# Altium project foxbms2-master.PrjPcb (part 7 of 7)

## Sheet connectors-interface.SchDoc
size A3; DocumentNumber: 12; SheetNumber: 12; SheetTotal: 45; SheetDescription: Connector to Interface Board
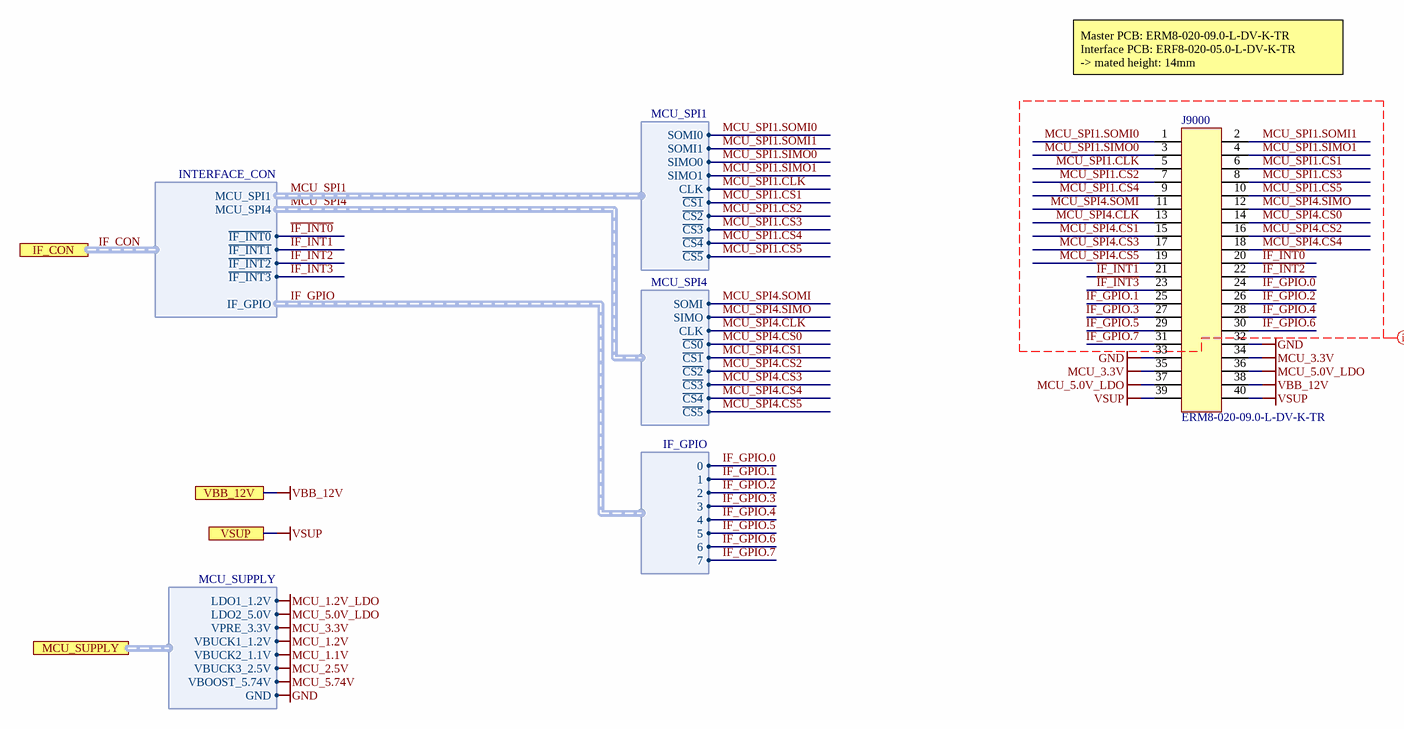
[diagram p22: connectors-interface.SchDoc]

### Parts
J9000  ERM8-020-09.0-L-DV-K-TR  [SAMTEC_ERM8-020-09.0-L-DV-K]

### Ports
IF_CON (harness INTERFACE_CON), MCU_SUPPLY (harness MCU_SUPPLY), VBB_12V, VSUP

### Harnesses
MCU_SPI1: CLK, SIMO0, SOMI0, SOMI1, ~{CS1}, ~{CS2}, ~{CS3}, ~{CS4}, ~{CS5}, SIMO1
MCU_SPI4: CLK, SIMO, SOMI, ~{CS1}, ~{CS2}, ~{CS3}, ~{CS0}, ~{CS4}, ~{CS5}
IF_GPIO: 0, 1, 2, 3, 4, 5, 6, 7
INTERFACE_CON: MCU_SPI1, MCU_SPI4, ~{IF_INT0}, ~{IF_INT1}, ~{IF_INT2}, ~{IF_INT3}, IF_GPIO
MCU_SUPPLY: VBUCK1_1.2V, VBUCK2_1.1V, VBUCK3_2.5V, LDO1_1.2V, LDO2_5.0V, GND, VPRE_3.3V, VBOOST_5.74V

### Nets
GND: J9000.32 J9000.33 ; port MCU_SUPPLY.GND
MCU_3.3V: J9000.34 J9000.35 ; port MCU_SUPPLY.VPRE_3.3V
MCU_5.0V_LDO: J9000.36 J9000.37 ; port MCU_SUPPLY.LDO2_5.0V
VBB_12V: J9000.38 ; port VBB_12V
VSUP: J9000.39 J9000.40 ; port VSUP  [project net VSUP_30]
~{IF_INT0}: J9000.20 ; port IF_CON.~{IF_INT0}  [project net IF_CON~{.}IF_INT0]
~{IF_INT1}: J9000.21 ; port IF_CON.~{IF_INT1}  [project net IF_CON~{.}IF_INT1]
~{IF_INT2}: J9000.22 ; port IF_CON.~{IF_INT2}  [project net IF_CON~{.}IF_INT2]
~{IF_INT3}: J9000.23 ; port IF_CON.~{IF_INT3}  [project net IF_CON~{.}IF_INT3]
~{MCU_SPI1.CS1}: J9000.6 ; harness MCU_SPI1.~{CS1}  [project net MCU_SPI1~{.}CS1]
~{MCU_SPI1.CS2}: J9000.7 ; harness MCU_SPI1.~{CS2}  [project net MCU_SPI1~{.}CS2]
~{MCU_SPI1.CS3}: J9000.8 ; harness MCU_SPI1.~{CS3}  [project net MCU_SPI1~{.}CS3]
~{MCU_SPI1.CS4}: J9000.9 ; harness MCU_SPI1.~{CS4}  [project net MCU_SPI1~{.}CS4]
~{MCU_SPI1.CS5}: J9000.10 ; harness MCU_SPI1.~{CS5}  [project net MCU_SPI1~{.}CS5]
~{MCU_SPI4.CS0}: J9000.14 ; harness MCU_SPI4.~{CS0}  [project net MCU_SPI4~{.}CS0]
~{MCU_SPI4.CS1}: J9000.15 ; harness MCU_SPI4.~{CS1}  [project net MCU_SPI4~{.}CS1]
~{MCU_SPI4.CS2}: J9000.16 ; harness MCU_SPI4.~{CS2}  [project net MCU_SPI4~{.}CS2]
~{MCU_SPI4.CS3}: J9000.17 ; harness MCU_SPI4.~{CS3}  [project net MCU_SPI4~{.}CS3]
~{MCU_SPI4.CS4}: J9000.18 ; harness MCU_SPI4.~{CS4}  [project net MCU_SPI4~{.}CS4]
~{MCU_SPI4.CS5}: J9000.19 ; harness MCU_SPI4.~{CS5}  [project net MCU_SPI4~{.}CS5]
IF_GPIO.0: J9000.24 ; harness IF_GPIO.0
IF_GPIO.1: J9000.25 ; harness IF_GPIO.1
IF_GPIO.2: J9000.26 ; harness IF_GPIO.2
IF_GPIO.3: J9000.27 ; harness IF_GPIO.3
IF_GPIO.4: J9000.28 ; harness IF_GPIO.4
IF_GPIO.5: J9000.29 ; harness IF_GPIO.5
IF_GPIO.6: J9000.30 ; harness IF_GPIO.6
IF_GPIO.7: J9000.31 ; harness IF_GPIO.7
MCU_SPI1.CLK: J9000.5 ; harness MCU_SPI1.CLK
MCU_SPI1.SIMO0: J9000.3 ; harness MCU_SPI1.SIMO0
MCU_SPI1.SIMO1: J9000.4 ; harness MCU_SPI1.SIMO1
MCU_SPI1.SOMI0: J9000.1 ; harness MCU_SPI1.SOMI0
MCU_SPI1.SOMI1: J9000.2 ; harness MCU_SPI1.SOMI1
MCU_SPI4.CLK: J9000.13 ; harness MCU_SPI4.CLK
MCU_SPI4.SIMO: J9000.12 ; harness MCU_SPI4.SIMO
MCU_SPI4.SOMI: J9000.11 ; harness MCU_SPI4.SOMI

### Buses and harness runs
harness IF_CON = port IF_CON

### Layout directives
net class CON_IF: IF_GPIO.0, IF_GPIO.1, IF_GPIO.2, IF_GPIO.3, IF_GPIO.4, IF_GPIO.5, IF_GPIO.6, IF_GPIO.7, MCU_SPI1.CLK, MCU_SPI1.SIMO0, MCU_SPI1.SIMO1, MCU_SPI1.SOMI0, MCU_SPI1.SOMI1, MCU_SPI4.CLK, MCU_SPI4.SIMO, MCU_SPI4.SOMI, ~{IF_INT0}, ~{IF_INT1}, ~{IF_INT2}, ~{IF_INT3}, ~{MCU_SPI1.CS1}, ~{MCU_SPI1.CS2}, ~{MCU_SPI1.CS3}, ~{MCU_SPI1.CS4}, ~{MCU_SPI1.CS5}, ~{MCU_SPI4.CS0}, ~{MCU_SPI4.CS1}, ~{MCU_SPI4.CS2}, ~{MCU_SPI4.CS3}, ~{MCU_SPI4.CS4}, ~{MCU_SPI4.CS5}

### Notes on the sheet
- Master PCB: ERM8-020-09.0-L-DV-K-TR
  Interface PCB: ERF8-020-05.0-L-DV-K-TR
  -> mated height: 14mm
- Fraunhofer IISB
- Schottkystr. 10
- developed by:
- 91058 Erlangen
- Germany
- Author
- Project
- License
- Description
- File
- Version
- Release Date
- Sheet
- foxbms.org <https://foxbms.org>
- www.iisb.fraunhofer.de <https://www.iisb.fraunhofer.de/>
- foxBMS Team
- /

### Library data of the parts
J9000 = SAMTEC_ERM8-020-09.0-L-DV-K-TR: Edge Rate rugged high-speed connector strips; Manufacturer: Samtec; Circuits: 40; Automotive Qualified: False; Part Number: SAMTEC_ERM8-020-09.0-L-DV-K-TR; Part Name: ERM8-020-09.0-L-DV-K-TR; Operating Temperature: -55°C - +125°C; ComponentLink1Description: Datasheet; ComponentLink1URL: https://suddendocs.samtec.com/catalog_english/erm8.pdf; Supplier 1: Farnell; Supplier Part Number 1: 3551150; Supplier 2: Samtec; Supplier Part Number 2: ERM8-020-09.0-L-DV-K-TR; Supplier 3: RS Components; Supplier Part Number 3: 1798876; ECCN: EAR99; System: Connector

## Sheet connectors-extension.SchDoc
size A3; DocumentNumber: 10; SheetNumber: 10; SheetTotal: 45; SheetDescription: Connector to Extension Board
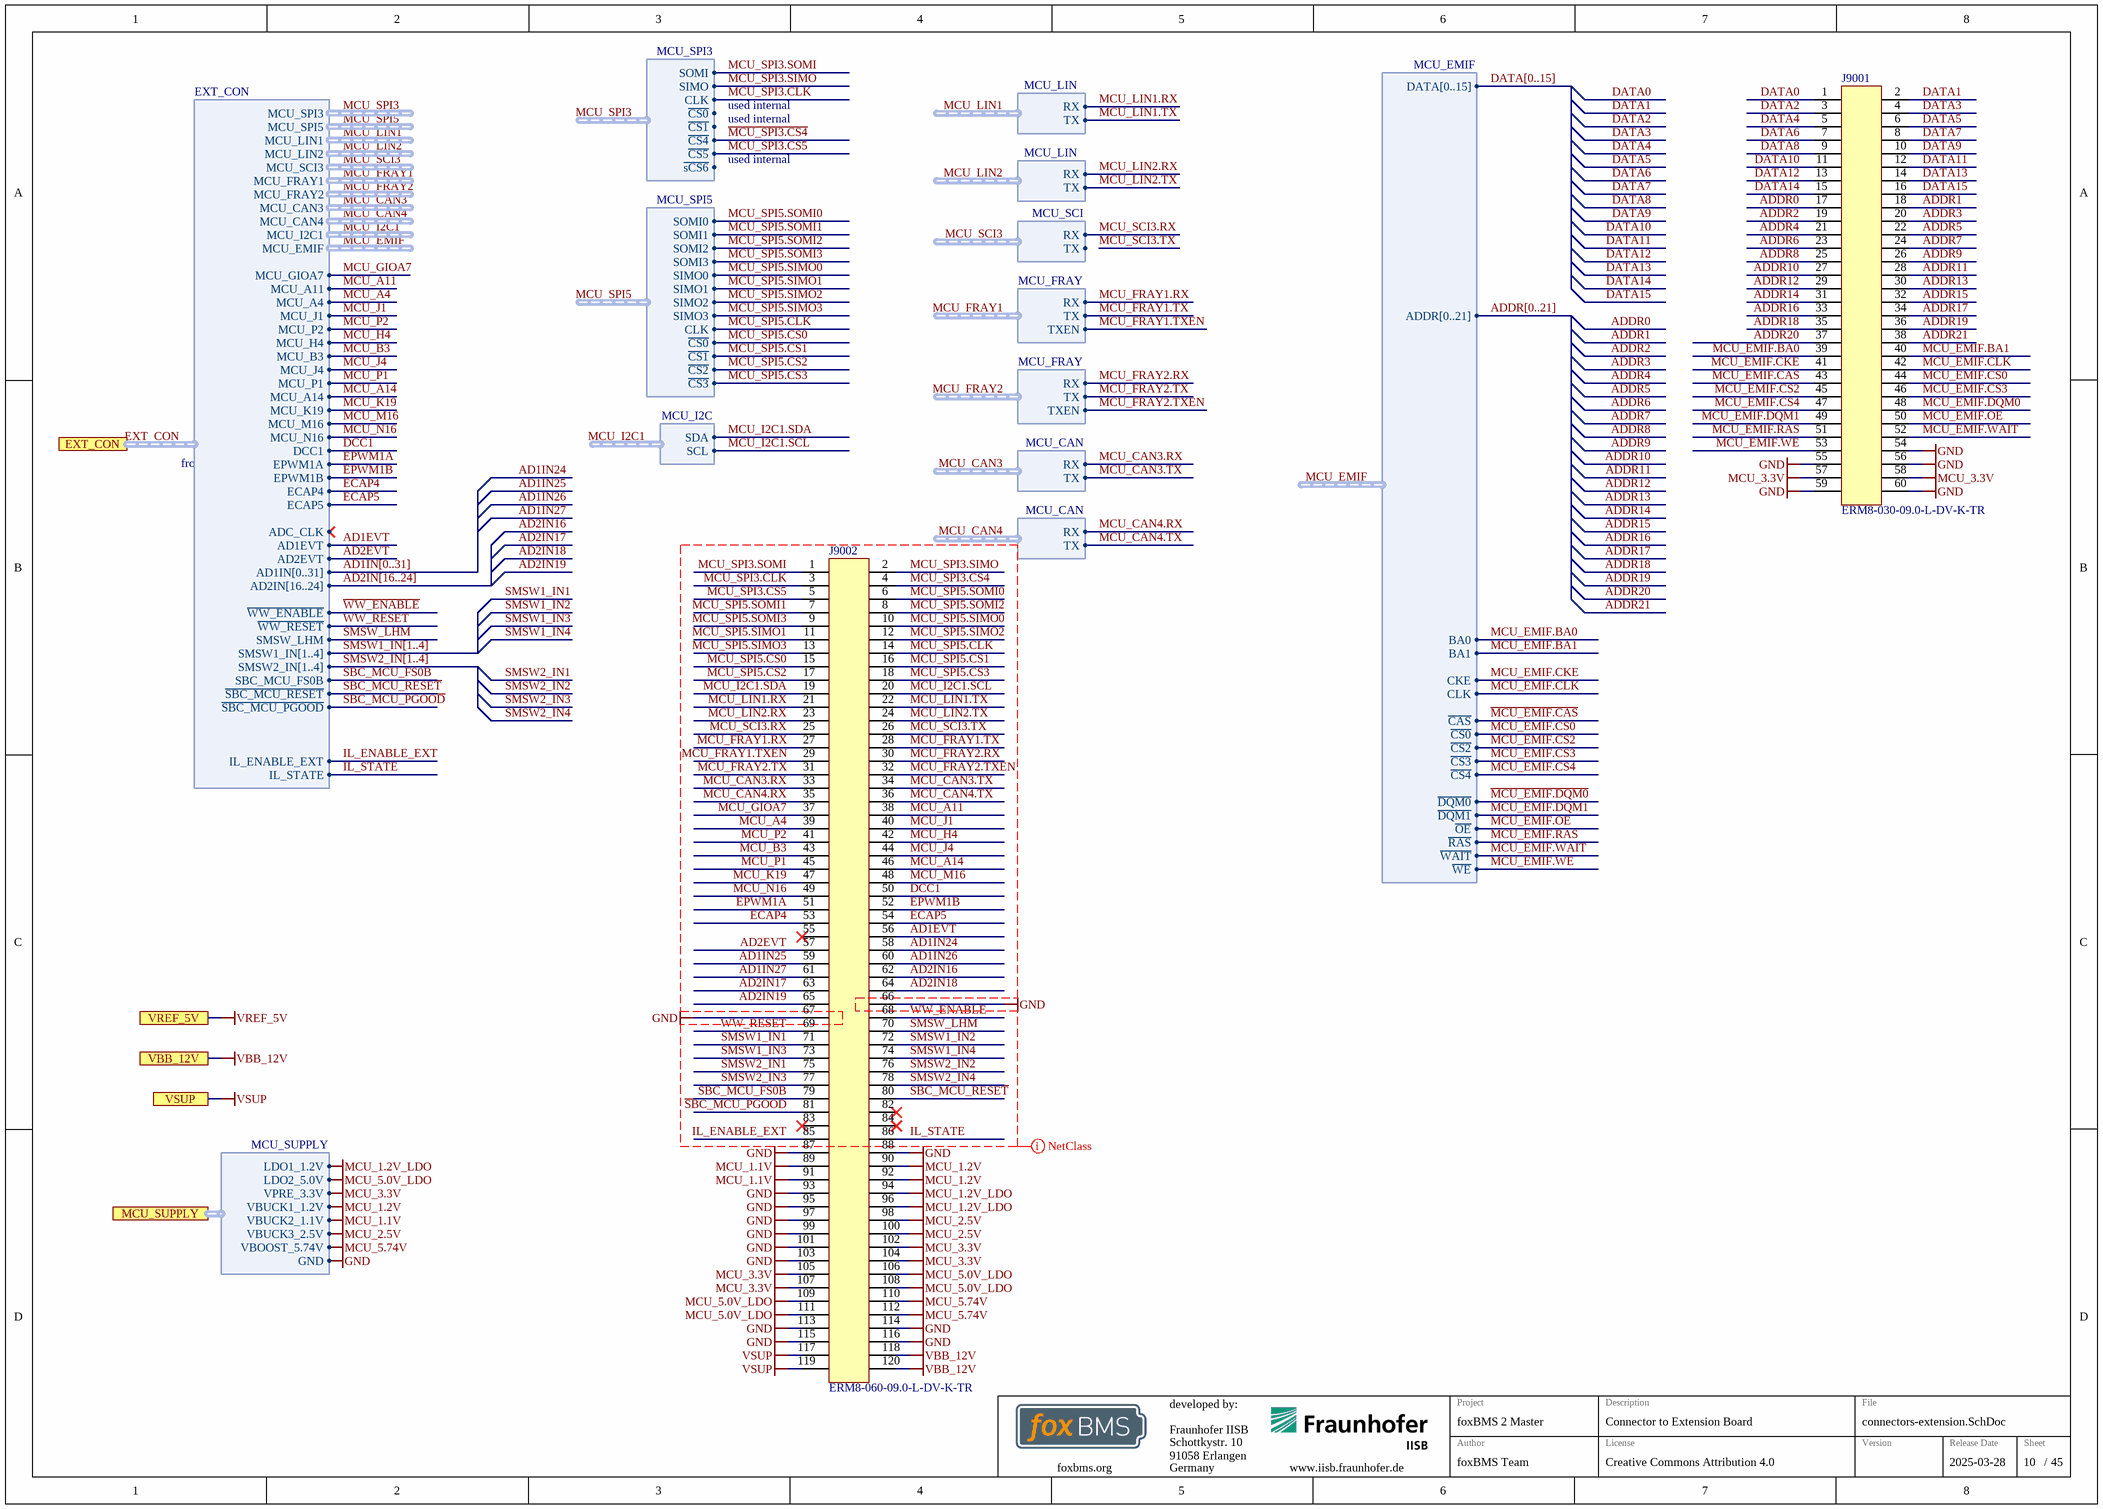
[diagram p23: connectors-extension.SchDoc]

### Parts
J9001  ERM8-030-09.0-L-DV-K-TR  [SAMTEC_ERM8-030-09.0-L-DV-K]
J9002  ERM8-060-09.0-L-DV-K-TR  [SAMTEC_ERM8-060-09.0-L-DV-K]

### Ports
EXT_CON (harness EXT_CON), MCU_SUPPLY (harness MCU_SUPPLY), VBB_12V, VREF_5V, VSUP

### Harnesses
MCU_SPI5: CLK, SIMO0, SOMI0, SOMI1, ~{CS1}, ~{CS2}, ~{CS3}, ~{CS0}, SIMO1, SIMO2, SIMO3, SOMI2, SOMI3
MCU_SPI3: CLK, SIMO, SOMI, ~{CS1}, ~{CS4}, ~{CS5}, ~{CS0}, ~{sCS6}
MCU_I2C: SDA, SCL
MCU_SUPPLY: VBUCK1_1.2V, VBUCK2_1.1V, VBUCK3_2.5V, LDO1_1.2V, LDO2_5.0V, GND, VPRE_3.3V, VBOOST_5.74V
MCU_EMIF: DATA[0..15], ADDR[0..21], BA0, BA1, CKE, CLK, ~{CAS}, ~{CS0}, ~{CS2}, ~{CS3}, ~{CS4}, ~{DQM1}, ~{DQM0}, ~{OE}, ~{RAS}, ~{WAIT}, ~{WE}
MCU_CAN: RX, TX
MCU_FRAY: RX, TX, TXEN
MCU_LIN: RX, TX
EXT_CON: MCU_SPI3, MCU_SPI5, MCU_LIN1, MCU_LIN2, MCU_FRAY1, MCU_FRAY2, MCU_CAN3, MCU_CAN4, MCU_I2C1, MCU_EMIF, DCC1, EPWM1A, EPWM1B, ECAP4, ECAP5, ADC_CLK, AD1EVT, AD2EVT, AD1IN[0..31], AD2IN[16..24], ~{WW_ENABLE}, ~{WW_RESET}, SMSW_LHM, SMSW1_IN[1..4], SMSW2_IN[1..4], SBC_MCU_FS0B, ~{SBC_MCU_RESET}, ~{SBC_MCU_PGOOD}, IL_ENABLE_EXT, IL_STATE, MCU_GIOA7, MCU_A11, MCU_A4, MCU_J1, MCU_P2, MCU_H4, MCU_B3, MCU_J4, MCU_P1, MCU_A14, MCU_K19, MCU_M16, MCU_N16, MCU_SCI3
MCU_SCI: RX, TX

### Nets
GND: J9001.54 J9001.55 J9001.56 J9001.59 J9001.60 J9002.66 J9002.67 J9002.87 J9002.88 J9002.93 J9002.95 J9002.97 J9002.99 J9002.101 J9002.103 J9002.113 J9002.114 J9002.115 J9002.116 ; port MCU_SUPPLY.GND
MCU_1.1V: J9002.89 J9002.91 ; port MCU_SUPPLY.VBUCK2_1.1V
MCU_1.2V: J9002.90 J9002.92 ; port MCU_SUPPLY.VBUCK1_1.2V
MCU_1.2V_LDO: J9002.94 J9002.96 ; port MCU_SUPPLY.LDO1_1.2V
MCU_2.5V: J9002.98 J9002.100 ; port MCU_SUPPLY.VBUCK3_2.5V
MCU_3.3V: J9001.57 J9001.58 J9002.102 J9002.104 J9002.105 J9002.107 ; port MCU_SUPPLY.VPRE_3.3V
MCU_5.0V_LDO: J9002.106 J9002.108 J9002.109 J9002.111 ; port MCU_SUPPLY.LDO2_5.0V
MCU_5.74V: J9002.110 J9002.112 ; port MCU_SUPPLY.VBOOST_5.74V
VBB_12V: J9002.118 J9002.120 ; port VBB_12V
VREF_5V: port VREF_5V
VSUP: J9002.117 J9002.119 ; port VSUP  [project net VSUP_30]
~{MCU_EMIF.CAS}: J9001.43 ; harness MCU_EMIF.~{CAS}  [project net MCU_EMIF~{.}CAS]
~{MCU_EMIF.CS0}: J9001.44 ; harness MCU_EMIF.~{CS0}  [project net MCU_EMIF~{.}CS0]
~{MCU_EMIF.CS2}: J9001.45 ; harness MCU_EMIF.~{CS2}  [project net MCU_EMIF~{.}CS2]
~{MCU_EMIF.CS3}: J9001.46 ; harness MCU_EMIF.~{CS3}  [project net MCU_EMIF~{.}CS3]
~{MCU_EMIF.CS4}: J9001.47 ; harness MCU_EMIF.~{CS4}  [project net MCU_EMIF~{.}CS4]
~{MCU_EMIF.DQM0}: J9001.48 ; harness MCU_EMIF.~{DQM0}  [project net MCU_EMIF~{.}DQM0]
~{MCU_EMIF.DQM1}: J9001.49 ; harness MCU_EMIF.~{DQM1}  [project net MCU_EMIF~{.}DQM1]
~{MCU_EMIF.OE}: J9001.50 ; harness MCU_EMIF.~{OE}  [project net MCU_EMIF~{.}OE]
~{MCU_EMIF.RAS}: J9001.51 ; harness MCU_EMIF.~{RAS}  [project net MCU_EMIF~{.}RAS]
~{MCU_EMIF.WAIT}: J9001.52 ; harness MCU_EMIF.~{WAIT}  [project net MCU_EMIF~{.}WAIT]
~{MCU_EMIF.WE}: J9001.53 ; harness MCU_EMIF.~{WE}  [project net MCU_EMIF~{.}WE]
~{MCU_SPI3.CS4}: J9002.4 ; harness MCU_SPI3.~{CS4}  [project net MCU_SPI3~{.}CS4]
~{MCU_SPI3.CS5}: J9002.5 ; harness MCU_SPI3.~{CS5}  [project net MCU_SPI3~{.}CS5]
~{MCU_SPI5.CS0}: J9002.15 ; harness MCU_SPI5.~{CS0}  [project net MCU_SPI5~{.}CS0]
~{MCU_SPI5.CS1}: J9002.16 ; harness MCU_SPI5.~{CS1}  [project net MCU_SPI5~{.}CS1]
~{MCU_SPI5.CS2}: J9002.17 ; harness MCU_SPI5.~{CS2}  [project net MCU_SPI5~{.}CS2]
~{MCU_SPI5.CS3}: J9002.18 ; harness MCU_SPI5.~{CS3}  [project net MCU_SPI5~{.}CS3]
~{SBC_MCU_PGOOD}: J9002.81 ; port EXT_CON.~{SBC_MCU_PGOOD}  [project net EXT_CON~{.}SBC_MCU_PGOOD]
~{SBC_MCU_RESET}: J9002.80 ; port EXT_CON.~{SBC_MCU_RESET}  [project net EXT_CON~{.}SBC_MCU_RESET]
~{WW_ENABLE}: J9002.68 ; port EXT_CON.~{WW_ENABLE}  [project net EXT_CON~{.}WW_ENABLE]
~{WW_RESET}: J9002.69 ; port EXT_CON.~{WW_RESET}  [project net ~{DBG_RESET}]
AD1EVT: J9002.56 ; port EXT_CON.AD1EVT  [project net EXT_CON.AD1EVT]
AD1IN24: J9002.58
AD1IN25: J9002.59
AD1IN26: J9002.60
AD1IN27: J9002.61
AD2EVT: J9002.57 ; port EXT_CON.AD2EVT  [project net EXT_CON.AD2EVT]
AD2IN16: J9002.62
AD2IN17: J9002.63
AD2IN18: J9002.64
AD2IN19: J9002.65
ADDR0: J9001.17
ADDR1: J9001.18
ADDR2: J9001.19
ADDR3: J9001.20
ADDR4: J9001.21
ADDR5: J9001.22
ADDR6: J9001.23
ADDR7: J9001.24
ADDR8: J9001.25
ADDR9: J9001.26
ADDR10: J9001.27
ADDR11: J9001.28
ADDR12: J9001.29
ADDR13: J9001.30
ADDR14: J9001.31
ADDR15: J9001.32
ADDR16: J9001.33
ADDR17: J9001.34
ADDR18: J9001.35
ADDR19: J9001.36
ADDR20: J9001.37
ADDR21: J9001.38
DATA0: J9001.1
DATA1: J9001.2
DATA2: J9001.3
DATA3: J9001.4
DATA4: J9001.5
DATA5: J9001.6
DATA6: J9001.7
DATA7: J9001.8
DATA8: J9001.9
DATA9: J9001.10
DATA10: J9001.11
DATA11: J9001.12
DATA12: J9001.13
DATA13: J9001.14
DATA14: J9001.15
DATA15: J9001.16
DCC1: J9002.50 ; port EXT_CON.DCC1  [project net EXT_CON.DCC1]
ECAP4: J9002.53 ; port EXT_CON.ECAP4  [project net EXT_CON.ECAP4]
ECAP5: J9002.54 ; port EXT_CON.ECAP5  [project net EXT_CON.ECAP5]
EPWM1A: J9002.51 ; port EXT_CON.EPWM1A  [project net EXT_CON.EPWM1A]
EPWM1B: J9002.52 ; port EXT_CON.EPWM1B  [project net EXT_CON.EPWM1B]
IL_ENABLE_EXT: J9002.85 ; port EXT_CON.IL_ENABLE_EXT  [project net EXT_CON.IL_ENABLE_EXT]
IL_STATE: J9002.86 ; port EXT_CON.IL_STATE  [project net EXT_CON.IL_STATE]
MCU_A4: J9002.39 ; port EXT_CON.MCU_A4  [project net EXT_CON.MCU_A4]
MCU_A11: J9002.38 ; port EXT_CON.MCU_A11  [project net EXT_CON.MCU_A11]
MCU_A14: J9002.46 ; port EXT_CON.MCU_A14  [project net EXT_CON.MCU_A14]
MCU_B3: J9002.43 ; port EXT_CON.MCU_B3  [project net EXT_CON.MCU_B3]
MCU_CAN3.RX: J9002.33 ; harness MCU_CAN.RX
MCU_CAN3.TX: J9002.34 ; harness MCU_CAN.TX
MCU_CAN4.RX: J9002.35 ; harness MCU_CAN.RX
MCU_CAN4.TX: J9002.36 ; harness MCU_CAN.TX
MCU_EMIF.BA0: J9001.39 ; harness MCU_EMIF.BA0
MCU_EMIF.BA1: J9001.40 ; harness MCU_EMIF.BA1
MCU_EMIF.CKE: J9001.41 ; harness MCU_EMIF.CKE
MCU_EMIF.CLK: J9001.42 ; harness MCU_EMIF.CLK
MCU_FRAY1.RX: J9002.27 ; harness MCU_FRAY.RX
MCU_FRAY1.TX: J9002.28 ; harness MCU_FRAY.TX
MCU_FRAY1.TXEN: J9002.29 ; harness MCU_FRAY.TXEN
MCU_FRAY2.RX: J9002.30 ; harness MCU_FRAY.RX
MCU_FRAY2.TX: J9002.31 ; harness MCU_FRAY.TX
MCU_FRAY2.TXEN: J9002.32 ; harness MCU_FRAY.TXEN
MCU_GIOA7: J9002.37 ; port EXT_CON.MCU_GIOA7  [project net EXT_CON.MCU_GIOA7]
MCU_H4: J9002.42 ; port EXT_CON.MCU_H4  [project net EXT_CON.MCU_H4]
MCU_I2C1.SCL: J9002.20 ; harness MCU_I2C.SCL
MCU_I2C1.SDA: J9002.19 ; harness MCU_I2C.SDA
MCU_J1: J9002.40 ; port EXT_CON.MCU_J1  [project net EXT_CON.MCU_J1]
MCU_J4: J9002.44 ; port EXT_CON.MCU_J4  [project net EXT_CON.MCU_J4]
MCU_K19: J9002.47 ; port EXT_CON.MCU_K19  [project net EXT_CON.MCU_K19]
MCU_LIN1.RX: J9002.21 ; harness MCU_LIN.RX
MCU_LIN1.TX: J9002.22 ; harness MCU_LIN.TX
MCU_LIN2.RX: J9002.23 ; harness MCU_LIN.RX
MCU_LIN2.TX: J9002.24 ; harness MCU_LIN.TX
MCU_M16: J9002.48 ; port EXT_CON.MCU_M16  [project net EXT_CON.MCU_M16]
MCU_N16: J9002.49 ; port EXT_CON.MCU_N16  [project net EXT_CON.MCU_N16]
MCU_P1: J9002.45 ; port EXT_CON.MCU_P1  [project net EXT_CON.MCU_P1]
MCU_P2: J9002.41 ; port EXT_CON.MCU_P2  [project net EXT_CON.MCU_P2]
MCU_SCI3.RX: J9002.25 ; harness MCU_SCI.RX
MCU_SCI3.TX: J9002.26  [project net MCU_SCI3.TX_10]
MCU_SPI3.CLK: J9002.3 ; harness MCU_SPI3.CLK  [project net FLASH_SPI.CLK]
MCU_SPI3.SIMO: J9002.2 ; harness MCU_SPI3.SIMO  [project net FLASH_SPI.MOSI]
MCU_SPI3.SOMI: J9002.1 ; harness MCU_SPI3.SOMI  [project net FLASH_SPI.MISO]
MCU_SPI5.CLK: J9002.14 ; harness MCU_SPI5.CLK
MCU_SPI5.SIMO0: J9002.10 ; harness MCU_SPI5.SIMO0
MCU_SPI5.SIMO1: J9002.11 ; harness MCU_SPI5.SIMO1
MCU_SPI5.SIMO2: J9002.12 ; harness MCU_SPI5.SIMO2
MCU_SPI5.SIMO3: J9002.13 ; harness MCU_SPI5.SIMO3
MCU_SPI5.SOMI0: J9002.6 ; harness MCU_SPI5.SOMI0
MCU_SPI5.SOMI1: J9002.7 ; harness MCU_SPI5.SOMI1
MCU_SPI5.SOMI2: J9002.8 ; harness MCU_SPI5.SOMI2
MCU_SPI5.SOMI3: J9002.9 ; harness MCU_SPI5.SOMI3
SBC_MCU_FS0B: J9002.79 ; port EXT_CON.SBC_MCU_FS0B  [project net EXT_CON.SBC_MCU_FS0B]
SMSW1_IN1: J9002.71
SMSW1_IN2: J9002.72
SMSW1_IN3: J9002.73
SMSW1_IN4: J9002.74
SMSW2_IN1: J9002.75
SMSW2_IN2: J9002.76
SMSW2_IN3: J9002.77
SMSW2_IN4: J9002.78
SMSW_LHM: J9002.70 ; port EXT_CON.SMSW_LHM  [project net EXT_CON.SMSW_LHM]

Not connected (* = marked no-connect by the designer): J9002 55* 82* 83* 84*

### Buses and harness runs
bus AD1IN[0..31]
bus AD2IN[16..24]
bus ADDR[0..21]
bus DATA[0..15]
bus SMSW1_IN[1..4]
bus SMSW2_IN[1..4]
harness EXT_CON = port EXT_CON

### Layout directives
net class CON_EXTENSION: AD1EVT, AD1IN24, AD1IN25, AD1IN26, AD1IN27, AD2EVT, AD2IN16, AD2IN17, AD2IN18, AD2IN19, DCC1, ECAP4, ECAP5, EPWM1A, EPWM1B, IL_ENABLE_EXT, IL_STATE, MCU_A4, MCU_A11, MCU_A14, MCU_B3, MCU_CAN3.RX, MCU_CAN3.TX, MCU_CAN4.RX, MCU_CAN4.TX, MCU_FRAY1.RX, MCU_FRAY1.TX, MCU_FRAY1.TXEN, MCU_FRAY2.RX, MCU_FRAY2.TX, MCU_FRAY2.TXEN, MCU_GIOA7, MCU_H4, MCU_I2C1.SCL, MCU_I2C1.SDA, MCU_J1, MCU_J4, MCU_K19, MCU_LIN1.RX, MCU_LIN1.TX, MCU_LIN2.RX, MCU_LIN2.TX, MCU_M16, MCU_N16, MCU_P1, MCU_P2, MCU_SCI3.RX, MCU_SCI3.TX, MCU_SPI3.CLK, MCU_SPI3.SIMO, MCU_SPI3.SOMI, MCU_SPI5.CLK, MCU_SPI5.SIMO0, MCU_SPI5.SIMO1, MCU_SPI5.SIMO2, MCU_SPI5.SIMO3, MCU_SPI5.SOMI0, MCU_SPI5.SOMI1, MCU_SPI5.SOMI2, MCU_SPI5.SOMI3, SBC_MCU_FS0B, SMSW1_IN1, SMSW1_IN2, SMSW1_IN3, SMSW1_IN4, SMSW2_IN1, SMSW2_IN2, SMSW2_IN3, SMSW2_IN4, SMSW_LHM, ~{MCU_SPI3.CS4}, ~{MCU_SPI3.CS5}, ~{MCU_SPI5.CS0}, ~{MCU_SPI5.CS1}, ~{MCU_SPI5.CS2}, ~{MCU_SPI5.CS3}, ~{SBC_MCU_PGOOD}, ~{SBC_MCU_RESET}, ~{WW_ENABLE}, ~{WW_RESET}

### Notes on the sheet
- used internal
- from IO matrix
- Fraunhofer IISB
- Schottkystr. 10
- developed by:
- 91058 Erlangen
- Germany
- Author
- Project
- License
- Description
- File
- Version
- Release Date
- Sheet
- foxbms.org <https://foxbms.org>
- www.iisb.fraunhofer.de <https://www.iisb.fraunhofer.de/>
- foxBMS Team
- /

### Library data of the parts
J9001 = SAMTEC_ERM8-030-09.0-L-DV-K-TR: Edge Rate rugged high-speed connector strips; Manufacturer: Samtec; Circuits: 60; Automotive Qualified: False; Part Number: SAMTEC_ERM8-030-09.0-L-DV-K-TR; Part Name: ERM8-030-09.0-L-DV-K-TR; Operating Temperature: -55°C - +125°C; ComponentLink1Description: Datasheet; ComponentLink1URL: https://suddendocs.samtec.com/catalog_english/erm8.pdf; Supplier 1: Digikey; Supplier Part Number 1: SAM13766CT-ND; Supplier 2: Mouser; Supplier Part Number 2: 200-ERM8030090LDVKTR; ECCN: EAR99
J9002 = SAMTEC_ERM8-060-09.0-L-DV-K-TR: Edge Rate rugged high-speed connector strips; Manufacturer: Samtec; Circuits: 120; Automotive Qualified: False; Part Number: SAMTEC_ERM8-060-09.0-L-DV-K-TR; Part Name: ERM8-060-09.0-L-DV-K-TR; Operating Temperature: -55°C - +125°C; ComponentLink1Description: Datasheet; ComponentLink1URL: https://suddendocs.samtec.com/catalog_english/erm8.pdf; Supplier 1: Digikey; Supplier Part Number 1: SAM13147CT-ND; Supplier 2: Mouser; Supplier Part Number 2: 200-ERM8060090LDVKTR; ECCN: EAR99

## Nets that join several sheets
GND: mcu-com-gpio-tim (D5000.1), connectors-external (J2009#2.4 J2009#2.5 J2009#2.8), connectors-internal (7 pins), window-watchdog (10 pins), rtc (11 pins), supply (8 pins), sbcs (6 pins), sbc-base (57 pins), interlock (32 pins), connectors-interface (J9000.32 J9000.33), connectors-extension (19 pins)
MCU_1.1V: sbcs (R7203.2), sbc-base (5 pins), connectors-extension (J9002.89 J9002.91)
MCU_1.2V: sbcs (R7202.2), sbc-base (5 pins), connectors-extension (J9002.90 J9002.92)
MCU_1.2V_LDO: sbcs (R7200.2), sbc-base (C7232.2 C7233.2 U7200.55), connectors-extension (J9002.94 J9002.96)
MCU_2.5V: sbcs (R7204.2), sbc-base (5 pins), connectors-extension (J9002.98 J9002.100)
MCU_3.3V: connectors-internal (6 pins), window-watchdog (R6601.2 R6605.2 R6608.2), rtc (8 pins), supply (R7002.2), sbc-base (29 pins), interlock (R8020.1 R8024.1), connectors-interface (J9000.34 J9000.35), connectors-extension (6 pins)
MCU_5.0V_LDO: window-watchdog (R6606.1), sbcs (R7201.2), sbc-base (C7234.2 C7235.2 U7200.54), interlock (10 pins), connectors-interface (J9000.36 J9000.37), connectors-extension (J9002.106 J9002.108 J9002.109 J9002.111)
MCU_5.74V: sbc-base (C7220.2 C7221.2 D7201.1 U7200.53), connectors-extension (J9002.110 J9002.112)
VBB_12V: connectors-external (8 pins), supply (R7001.2 TP_VBB_12V.1), interlock (5 pins), connectors-interface (J9000.38), connectors-extension (J9002.118 J9002.120)
VSUP_30: window-watchdog (C6605.2 R6607.1 U6601.5 U6601.8), rtc (R6400.2 R6402.2), supply (D7006.1 R7004.2 TP_VSUP_30.1), sbc-base (9 pins), connectors-interface (J9000.39 J9000.40), connectors-extension (J9002.117 J9002.119)
~{DBG_RESET}: connectors-internal (C3000.2 J3008.9 R3004.1), window-watchdog (D6601.1 R6601.1 R6603.2 S6600.2), connectors-extension (J9002.69)
AD1IN24: mcu-adc (U5000.N18), connectors-extension (J9002.58)
AD1IN25: mcu-adc (U5000.P17), connectors-extension (J9002.59)
AD1IN26: mcu-adc (U5000.P16), connectors-extension (J9002.60)
AD1IN27: mcu-adc (U5000.P15), connectors-extension (J9002.61)
AD2IN16: mcu-adc (U5000.W13), connectors-extension (J9002.62)
AD2IN17: mcu-adc (U5000.W12), connectors-extension (J9002.63)
AD2IN18: mcu-adc (U5000.V12), connectors-extension (J9002.64)
AD2IN19: mcu-adc (U5000.U12), connectors-extension (J9002.65)
ADDR0: mcu-emif-etm-dmm (U5000.D4), connectors-extension (J9001.17)
ADDR1: mcu-emif-etm-dmm (U5000.D5), connectors-extension (J9001.18)
ADDR2: mcu-emif-etm-dmm (U5000.E6), connectors-extension (J9001.19)
ADDR3: mcu-emif-etm-dmm (U5000.E7), connectors-extension (J9001.20)
ADDR4: mcu-emif-etm-dmm (U5000.E8), connectors-extension (J9001.21)
ADDR5: mcu-emif-etm-dmm (U5000.E9), connectors-extension (J9001.22)
ADDR6: mcu-emif-etm-dmm (U5000.C4), connectors-extension (J9001.23)
ADDR7: mcu-emif-etm-dmm (U5000.C5), connectors-extension (J9001.24)
ADDR8: mcu-emif-etm-dmm (U5000.C6), connectors-extension (J9001.25)
ADDR9: mcu-emif-etm-dmm (U5000.C7), connectors-extension (J9001.26)
ADDR10: mcu-emif-etm-dmm (U5000.C8), connectors-extension (J9001.27)
ADDR11: mcu-emif-etm-dmm (U5000.C9), connectors-extension (J9001.28)
ADDR12: mcu-emif-etm-dmm (U5000.C10), connectors-extension (J9001.29)
ADDR13: mcu-emif-etm-dmm (U5000.C11), connectors-extension (J9001.30)
ADDR14: mcu-emif-etm-dmm (U5000.C12), connectors-extension (J9001.31)
ADDR15: mcu-emif-etm-dmm (U5000.C13), connectors-extension (J9001.32)
ADDR16: mcu-emif-etm-dmm (U5000.D14), connectors-extension (J9001.33)
ADDR17: mcu-emif-etm-dmm (U5000.C14), connectors-extension (J9001.34)
ADDR18: mcu-emif-etm-dmm (U5000.D15), connectors-extension (J9001.35)
ADDR19: mcu-emif-etm-dmm (U5000.C15), connectors-extension (J9001.36)
ADDR20: mcu-emif-etm-dmm (U5000.C16), connectors-extension (J9001.37)
ADDR21: mcu-emif-etm-dmm (U5000.C17), connectors-extension (J9001.38)
DATA0: mcu-emif-etm-dmm (U5000.K15), connectors-extension (J9001.1)
DATA1: mcu-emif-etm-dmm (U5000.L15), connectors-extension (J9001.2)
DATA2: mcu-emif-etm-dmm (U5000.M15), connectors-extension (J9001.3)
DATA3: mcu-emif-etm-dmm (U5000.N15), connectors-extension (J9001.4)
DATA4: mcu-emif-etm-dmm (U5000.E5), connectors-extension (J9001.5)
DATA5: mcu-emif-etm-dmm (U5000.F5), connectors-extension (J9001.6)
DATA6: mcu-emif-etm-dmm (U5000.G5), connectors-extension (J9001.7)
DATA7: mcu-emif-etm-dmm (U5000.K5), connectors-extension (J9001.8)
DATA8: mcu-emif-etm-dmm (U5000.L5), connectors-extension (J9001.9)
DATA9: mcu-emif-etm-dmm (U5000.M5), connectors-extension (J9001.10)
DATA10: mcu-emif-etm-dmm (U5000.N5), connectors-extension (J9001.11)
DATA11: mcu-emif-etm-dmm (U5000.P5), connectors-extension (J9001.12)
DATA12: mcu-emif-etm-dmm (U5000.R5), connectors-extension (J9001.13)
DATA13: mcu-emif-etm-dmm (U5000.R6), connectors-extension (J9001.14)
DATA14: mcu-emif-etm-dmm (U5000.R7), connectors-extension (J9001.15)
DATA15: mcu-emif-etm-dmm (U5000.R8), connectors-extension (J9001.16)
EXT_CON~{.}SBC_MCU_PGOOD: sbc-base (C7237.2 R7241.1 R7249.2), connectors-extension (J9002.81)
EXT_CON~{.}SBC_MCU_RESET: window-watchdog (C6604.2 R6605.1 U6600.2), sbc-base (C7236.2 R7240.1 R7248.1), connectors-extension (J9002.80)
EXT_CON~{.}WW_ENABLE: window-watchdog (R6600.1 R6602.2), connectors-extension (J9002.68)
EXT_CON.AD1EVT: mcu-adc (U5000.N19), connectors-extension (J9002.56)
EXT_CON.AD2EVT: mcu-adc (U5000.T10), connectors-extension (J9002.57)
EXT_CON.DCC1: mcu-com-gpio-tim (U5000.J17), connectors-extension (J9002.50)
EXT_CON.ECAP4: mcu-com-gpio-tim (U5000.G19), connectors-extension (J9002.53)
EXT_CON.ECAP5: mcu-com-gpio-tim (U5000.H18), connectors-extension (J9002.54)
EXT_CON.EPWM1A: mcu-com-gpio-tim (U5000.D9), connectors-extension (J9002.51)
EXT_CON.EPWM1B: mcu-com-gpio-tim (U5000.D10), connectors-extension (J9002.52)
EXT_CON.IL_ENABLE_EXT: interlock (R8026.1), connectors-extension (J9002.85)
EXT_CON.IL_STATE: mcu-com-gpio-tim (U5000.A3), interlock (R8020.2 U8002.7), connectors-extension (J9002.86)
EXT_CON.MCU_A4: mcu-com-gpio-tim (U5000.A4), connectors-extension (J9002.39)
EXT_CON.MCU_A11: mcu-com-gpio-tim (U5000.A11), connectors-extension (J9002.38)
EXT_CON.MCU_A14: mcu-com-gpio-tim (U5000.A14), connectors-extension (J9002.46)
EXT_CON.MCU_B3: mcu-com-gpio-tim (U5000.B3), connectors-extension (J9002.43)
EXT_CON.MCU_GIOA7: mcu-com-gpio-tim (U5000.M1), connectors-extension (J9002.37)
EXT_CON.MCU_H4: mcu-com-gpio-tim (U5000.H4), connectors-extension (J9002.42)
EXT_CON.MCU_J1: mcu-com-gpio-tim (U5000.J1), connectors-extension (J9002.40)
EXT_CON.MCU_J4: mcu-com-gpio-tim (U5000.J4), connectors-extension (J9002.44)
EXT_CON.MCU_K19: mcu-com-gpio-tim (U5000.K19), connectors-extension (J9002.47)
EXT_CON.MCU_M16: mcu-com-gpio-tim (U5000.M16), connectors-extension (J9002.48)
EXT_CON.MCU_N16: mcu-com-gpio-tim (U5000.N16), connectors-extension (J9002.49)
EXT_CON.MCU_P1: mcu-com-gpio-tim (U5000.P1), connectors-extension (J9002.45)
EXT_CON.MCU_P2: mcu-com-gpio-tim (U5000.P2), connectors-extension (J9002.41)
EXT_CON.SBC_MCU_FS0B: sbc-base (C7243.2 R7243.2), connectors-extension (J9002.79)
FLASH_SPI.CLK: mcu-com-gpio-tim (U5000.V9), connectors-extension (J9002.3)
FLASH_SPI.MISO: mcu-com-gpio-tim (U5000.V8), connectors-extension (J9002.1)
FLASH_SPI.MOSI: mcu-com-gpio-tim (U5000.W8), connectors-extension (J9002.2)
IF_CON~{.}IF_INT0: mcu-com-gpio-tim (U5000.C1), connectors-interface (J9000.20)
IF_CON~{.}IF_INT1: mcu-com-gpio-tim (U5000.E1), connectors-interface (J9000.21)
IF_CON~{.}IF_INT2: mcu-com-gpio-tim (U5000.A6), connectors-interface (J9000.22)
IF_CON~{.}IF_INT3: mcu-com-gpio-tim (U5000.H3), connectors-interface (J9000.23)
INTERLOCK.HI: connectors-external (J2033#2.1), interlock (5 pins)
INTERLOCK.LO: connectors-external (J2033#2.2), interlock (D8001.5 R8010.2 R8014.2 R8016.1)
INTERLOCK_IO.IL_HS_CS: mcu-adc (U5000.U18), interlock (C8001.2 R8006.1 TP8001.1)
INTERLOCK_IO.IL_HS_ENABLE: mcu-com-gpio-tim (U5000.B11), interlock (R8027.1)
INTERLOCK_IO.IL_HS_VS: mcu-adc (U5000.V18), interlock (C8000.2 R8001.1 TP8000.1)
INTERLOCK_IO.IL_LS_CS: mcu-adc (U5000.R17), interlock (C8005.2 R8015.1 TP8003.1)
INTERLOCK_IO.IL_LS_VS: mcu-adc (U5000.T17), interlock (C8002.2 R8009.1 TP8002.1)
MCU_CAN3.RX: mcu-com-gpio-tim (U5000.M19), connectors-extension (J9002.33)
MCU_CAN3.TX: mcu-com-gpio-tim (U5000.M18), connectors-extension (J9002.34)
MCU_CAN4.RX: mcu-com-gpio-tim (U5000.W10), connectors-extension (J9002.35)
MCU_CAN4.TX: mcu-com-gpio-tim (U5000.F2), connectors-extension (J9002.36)
MCU_DCC.2: mcu-com-gpio-tim (U5000.D6), rtc (U6400.6)
MCU_EMIF~{.}CAS: mcu-emif-etm-dmm (U5000.R4), connectors-extension (J9001.43)
MCU_EMIF~{.}CS0: mcu-emif-etm-dmm (U5000.N17), connectors-extension (J9001.44)
MCU_EMIF~{.}CS2: mcu-emif-etm-dmm (U5000.L17), connectors-extension (J9001.45)
MCU_EMIF~{.}CS3: mcu-emif-etm-dmm (U5000.K17), connectors-extension (J9001.46)
MCU_EMIF~{.}CS4: mcu-emif-etm-dmm (U5000.M17), connectors-extension (J9001.47)
MCU_EMIF~{.}DQM0: mcu-emif-etm-dmm (U5000.E10), connectors-extension (J9001.48)
MCU_EMIF~{.}DQM1: mcu-emif-etm-dmm (U5000.E11), connectors-extension (J9001.49)
MCU_EMIF~{.}OE: mcu-emif-etm-dmm (U5000.E12), connectors-extension (J9001.50)
MCU_EMIF~{.}RAS: mcu-emif-etm-dmm (U5000.R3), connectors-extension (J9001.51)
MCU_EMIF~{.}WAIT: mcu-emif-etm-dmm (U5000.P3), connectors-extension (J9001.52)
MCU_EMIF~{.}WE: mcu-emif-etm-dmm (U5000.D17), connectors-extension (J9001.53)
MCU_EMIF.BA0: mcu-emif-etm-dmm (U5000.E13), connectors-extension (J9001.39)
MCU_EMIF.BA1: mcu-emif-etm-dmm (U5000.D16), connectors-extension (J9001.40)
MCU_EMIF.CKE: mcu-emif-etm-dmm (U5000.L3), connectors-extension (J9001.41)
MCU_EMIF.CLK: mcu-emif-etm-dmm (U5000.K3), connectors-extension (J9001.42)
MCU_ETM.CLKIN: mcu-emif-etm-dmm (U5000.R9), connectors-internal (R3009.1)
MCU_ETM.CLKOUT: mcu-emif-etm-dmm (U5000.R10), connectors-internal (J3008.6)
MCU_ETM.CTL: mcu-emif-etm-dmm (U5000.R11), connectors-internal (J3008.36)
MCU_ETM.DATA0: mcu-emif-etm-dmm (U5000.R12), connectors-internal (J3008.38)
MCU_ETM.DATA1: mcu-emif-etm-dmm (U5000.R13), connectors-internal (J3008.28)
MCU_ETM.DATA2: mcu-emif-etm-dmm (U5000.J15), connectors-internal (J3008.26)
MCU_ETM.DATA3: mcu-emif-etm-dmm (U5000.H15), connectors-internal (J3008.24)
MCU_ETM.DATA4: mcu-emif-etm-dmm (U5000.G15), connectors-internal (J3008.22)
MCU_ETM.DATA5: mcu-emif-etm-dmm (U5000.F15), connectors-internal (J3008.20)
MCU_ETM.DATA6: mcu-emif-etm-dmm (U5000.E15), connectors-internal (J3008.18)
MCU_ETM.DATA7: mcu-emif-etm-dmm (U5000.E14), connectors-internal (J3008.16)
MCU_FRAY1.RX: mcu-com-gpio-tim (U5000.A15), connectors-extension (J9002.27)
MCU_FRAY1.TX: mcu-com-gpio-tim (U5000.B15), connectors-extension (J9002.28)
MCU_FRAY1.TXEN: mcu-com-gpio-tim (U5000.B16), connectors-extension (J9002.29)
MCU_FRAY2.RX: mcu-com-gpio-tim (U5000.A8), connectors-extension (J9002.30)
MCU_FRAY2.TX: mcu-com-gpio-tim (U5000.B8), connectors-extension (J9002.31)
MCU_FRAY2.TXEN: mcu-com-gpio-tim (U5000.B9), connectors-extension (J9002.32)
MCU_GIOA.0: mcu-com-gpio-tim (U5000.A5), sbc-base (U7200.33)
MCU_GIOB.1: mcu-com-gpio-tim (U5000.K2), rtc (R6401.1 U6400.12)
MCU_GIOX.D11: mcu-com-gpio-tim (U5000.D11), rtc (R6410.1 U6400.10)
MCU_GIOX.D12: mcu-com-gpio-tim (U5000.D12), rtc (R6409.1 U6400.9)
MCU_GIOX.D13: mcu-com-gpio-tim (U5000.D13), rtc (R6408.1 U6400.8)
MCU_GIOX.K4: mcu-com-gpio-tim (U5000.K4), window-watchdog (R6604.1)
MCU_GIOX.K16: mcu-com-gpio-tim (U5000.K16), rtc (R6411.1 U6400.11)
MCU_GIOX.T7: mcu-com-gpio-tim (U5000.T7), sbc-base (U7200.30)
MCU_I2C1.SCL: mcu-com-gpio-tim (U5000.C3), rtc (R6403.1 U6400.2), connectors-extension (J9002.20)
MCU_I2C1.SDA: mcu-com-gpio-tim (U5000.B2), rtc (R6404.1 U6400.5), connectors-extension (J9002.19)
MCU_LIN1.RX: mcu-com-gpio-tim (U5000.A7), connectors-extension (J9002.21)
MCU_LIN1.TX: mcu-com-gpio-tim (U5000.B7), connectors-extension (J9002.22)
MCU_LIN2.RX: mcu-com-gpio-tim (U5000.P4), connectors-extension (J9002.23)
MCU_LIN2.TX: mcu-com-gpio-tim (U5000.T5), connectors-extension (J9002.24)
MCU_SCI3.RX: mcu-com-gpio-tim (U5000.W3), connectors-extension (J9002.25)
MCU_SPI1~{.}CS1: mcu-com-gpio-tim (U5000.F3), connectors-interface (J9000.6)
MCU_SPI1~{.}CS2: mcu-com-gpio-tim (U5000.G3), connectors-interface (J9000.7)
MCU_SPI1~{.}CS3: mcu-com-gpio-tim (U5000.J3), connectors-interface (J9000.8)
MCU_SPI1~{.}CS4: mcu-com-gpio-tim (U5000.U10), connectors-interface (J9000.9)
MCU_SPI1~{.}CS5: mcu-com-gpio-tim (U5000.U9), connectors-interface (J9000.10)
MCU_SPI1.CLK: mcu-com-gpio-tim (U5000.F18), connectors-interface (J9000.5)
MCU_SPI1.SIMO0: mcu-com-gpio-tim (U5000.F19), connectors-interface (J9000.3)
MCU_SPI1.SIMO1: mcu-com-gpio-tim (U5000.E18), connectors-interface (J9000.4)
MCU_SPI1.SOMI0: mcu-com-gpio-tim (U5000.G18), connectors-interface (J9000.1)
MCU_SPI1.SOMI1: mcu-com-gpio-tim (U5000.R2), connectors-interface (J9000.2)
MCU_SPI2~{.}CS0: mcu-com-gpio-tim (U5000.N3), sbc-base (R7247.1)
MCU_SPI2.CLK: mcu-com-gpio-tim (U5000.E2), sbc-base (U7200.27)
MCU_SPI2.SIMO: mcu-com-gpio-tim (U5000.D1), sbc-base (U7200.26)
MCU_SPI2.SOMI: mcu-com-gpio-tim (U5000.D2), sbc-base (U7200.25)
MCU_SPI3~{.}CS4: mcu-com-gpio-tim (U5000.E3), connectors-extension (J9002.4)
MCU_SPI3~{.}CS5: mcu-com-gpio-tim (U5000.W9), connectors-extension (J9002.5)
MCU_SPI4~{.}CS0: mcu-com-gpio-tim (U5000.U1), connectors-interface (J9000.14)
MCU_SPI4~{.}CS1: mcu-com-gpio-tim (U5000.B12), connectors-interface (J9000.15)
MCU_SPI4~{.}CS2: mcu-com-gpio-tim (U5000.T1), connectors-interface (J9000.16)
MCU_SPI4~{.}CS3: mcu-com-gpio-tim (U5000.V7), connectors-interface (J9000.17)
MCU_SPI4~{.}CS4: mcu-com-gpio-tim (U5000.D19), connectors-interface (J9000.18)
MCU_SPI4~{.}CS5: mcu-com-gpio-tim (U5000.B4), connectors-interface (J9000.19)
MCU_SPI4.CLK: mcu-com-gpio-tim (U5000.K18), connectors-interface (J9000.13)
MCU_SPI4.SIMO: mcu-com-gpio-tim (U5000.W5), connectors-interface (J9000.12)
MCU_SPI4.SOMI: mcu-com-gpio-tim (U5000.V6), connectors-interface (J9000.11)
MCU_SPI5~{.}CS0: mcu-com-gpio-tim (U5000.E19), connectors-extension (J9002.15)
MCU_SPI5~{.}CS1: mcu-com-gpio-tim (U5000.B6), connectors-extension (J9002.16)
MCU_SPI5~{.}CS2: mcu-com-gpio-tim (U5000.W6), connectors-extension (J9002.17)
MCU_SPI5~{.}CS3: mcu-com-gpio-tim (U5000.T12), connectors-extension (J9002.18)
MCU_SPI5.CLK: mcu-com-gpio-tim (U5000.H19), connectors-extension (J9002.14)
MCU_SPI5.SIMO0: mcu-com-gpio-tim (U5000.J19), connectors-extension (J9002.10)
MCU_SPI5.SIMO1: mcu-com-gpio-tim (U5000.E16), connectors-extension (J9002.11)
MCU_SPI5.SIMO2: mcu-com-gpio-tim (U5000.H17), connectors-extension (J9002.12)
MCU_SPI5.SIMO3: mcu-com-gpio-tim (U5000.G17), connectors-extension (J9002.13)
MCU_SPI5.SOMI0: mcu-com-gpio-tim (U5000.J18), connectors-extension (J9002.6)
MCU_SPI5.SOMI1: mcu-com-gpio-tim (U5000.E17), connectors-extension (J9002.7)
MCU_SPI5.SOMI2: mcu-com-gpio-tim (U5000.H16), connectors-extension (J9002.8)
MCU_SPI5.SOMI3: mcu-com-gpio-tim (U5000.G16), connectors-extension (J9002.9)
NetC7201_1: sbcs (C7201.1 R7210.2), sbc-base (U7200.41)
PER_IO~{.}RTC_INTA_HV: rtc (Q6400.D R6412.1 R6413.1), io-matrix (D6400.2)
SBC_MCU_OTP.DBG: connectors-internal (J3000.6), sbc-base (D7203.2)
SBC_MCU_OTP.DBGHV: connectors-internal (J3000.4), sbc-base (D7203.1 R7235.1 U7200.8)
SBC_MCU_OTP.SCL: connectors-internal (J3000.5), sbc-base (R7237.1 U7200.10)
SBC_MCU_OTP.SDA: connectors-internal (J3000.3), sbc-base (R7236.1 U7200.11)
SUPPLY_ext.15_IGNITION: connectors-external (J2009#2.1), supply (R7005.2)
SUPPLY_IO.IGNITION: supply (D7004.1), sbc-base (C7217.2 R7229.2 S7200.1)
SUPPLY_IO.SBC_MCU_ADC: mcu-adc (U5000.W14), sbc-base (C7245.2 R7244.2)
SUPPLY_IO.SBC_MCU_WAKE2: sbc-base (C7225.2 R7231.2), io-matrix (D1100.1 D6400.1)
SUPPLY_IO.VSUP_30C_SENSE: mcu-adc (U5000.T19), supply (C7001.2 R7007.2)
VCOREMON: sbcs (R7202.1), sbc-base (U7200.17)
VMON1: sbcs (R7203.1 R7208.2), sbc-base (U7200.16)
VMON2: sbcs (R7204.1 R7209.2), sbc-base (U7200.15)
VMON3: sbcs (R7200.1 R7205.2), sbc-base (U7200.13)
VMON4: sbcs (R7201.1 R7206.2), sbc-base (U7200.12)

## Assembly variants
default: not fitted BT6401 Q1101_2 R1100 R1106 R1114_2 R1115_2 R1200 R1201 R1203 R1205 R1207 R1208 R1210 R1212 R1213 R1214 R1224 R1226 R1601 R1602 R1603 R1604 R1609 R1610 R1611 R1612 R1613 R4202_1 R4202_2 R4202_3 R4202_4 R4202_5 R4202_6 R4202_7 R4202_8 R4204_1 R4204_2 R4204_3 R4204_4 R4204_5 R4204_6 R4204_7 R4204_8 R4410 R4504_1 R4504_2 R4505_1 R4505_2 R4506_1 R4506_2 R4507_1 R4507_2 R4514_1 R4514_2 R4515_1 R4515_2 R4516_1 R4516_2 R4517_1 R4517_2 R6100 R6302_1 R6302_2 R6302_3 R6303_1 R6303_2 R6303_3 R6304_1 R6304_2 R6304_3 R6305_1 R6305_2 R6305_3 R6306_1 R6306_2 R6306_3 R6307_1 R6307_2 R6307_3 R6308_1 R6308_2 R6308_3 R6309_1 R6309_2 R6309_3 R6310_1 R6310_2 R6310_3 R6311_1 R6311_2 R6311_3 R6312_1 R6312_2 R6312_3 R6313_1 R6313_2 R6313_3 R6314_1 R6314_2 R6314_3 R6315_1 R6315_2 R6315_3 R6316_1 R6316_2 R6316_3 R6317_1 R6317_2 R6317_3 R6320_1 R6321_1 R6322_1 R6323_1 R6324_1 R6325_1 R6326_1 R6327_1 R6403 R6404 R6500 R6501 R6603 R6606 R6607 R7219 R7310_1 R7310_2 U8000
production: not fitted BT6401 C7100 C7101 C7102 C7103 C7104 C7105 C7106 C7107 C7108 C7109 C7110 C7111 C7112 C7113 C7114 C7115 C7116 C7117 C7118 C7119 C7120 D7100 D7101 D7102 J3000 L7100 Q1101_2 Q7100 Q7101 Q7102 Q7103 R1103_1 R1103_2 R1104_1 R1104_2 R1106 R1114_2 R1115_2 R1200 R1201 R1203 R1205 R1207 R1208 R1210 R1212 R1213 R1214 R1224 R1226 R1601 R1602 R1603 R1604 R1609 R1610 R1611 R1612 R1613 R4202_1 R4202_2 R4202_3 R4202_4 R4202_5 R4202_6 R4202_7 R4202_8 R4204_1 R4204_2 R4204_3 R4204_4 R4204_5 R4204_6 R4204_7 R4204_8 R4410 R4504_1 R4504_2 R4505_1 R4505_2 R4506_1 R4506_2 R4507_1 R4507_2 R4514_1 R4514_2 R4515_1 R4515_2 R4516_1 R4516_2 R4517_1 R4517_2 R6100 R6101 R6302_1 R6302_2 R6302_3 R6303_1 R6303_2 R6303_3 R6304_1 R6304_2 R6304_3 R6305_1 R6305_2 R6305_3 R6306_1 R6306_2 R6306_3 R6307_1 R6307_2 R6307_3 R6308_1 R6308_2 R6308_3 R6309_1 R6309_2 R6309_3 R6310_1 R6310_2 R6310_3 R6311_1 R6311_2 R6311_3 R6312_1 R6312_2 R6312_3 R6313_1 R6313_2 R6313_3 R6314_1 R6314_2 R6314_3 R6315_1 R6315_2 R6315_3 R6316_1 R6316_2 R6316_3 R6317_2 R6317_3 R6320_1 R6321_1 R6322_1 R6323_1 R6324_1 R6325_1 R6326_1 R6327_1 R6335_1 R6403 R6404 R6500 R6501 R6603 R6606 R6607 R7100 R7101 R7102 R7103 R7104 R7105 R7106 R7107 R7108 R7109 R7110 R7111 R7112 R7113 R7114 R7219 R7310_1 R7310_2 U6202 U7100 U8000; alternate parts U1100 -> ADUM6401CRIZ, Y6100 -> SiT1618BA-32-33N-20.000000, Y6101 -> SiT1618BA-31-33N-25.000000